# Altium schematic sheet Sheet1.SchDoc
size A4
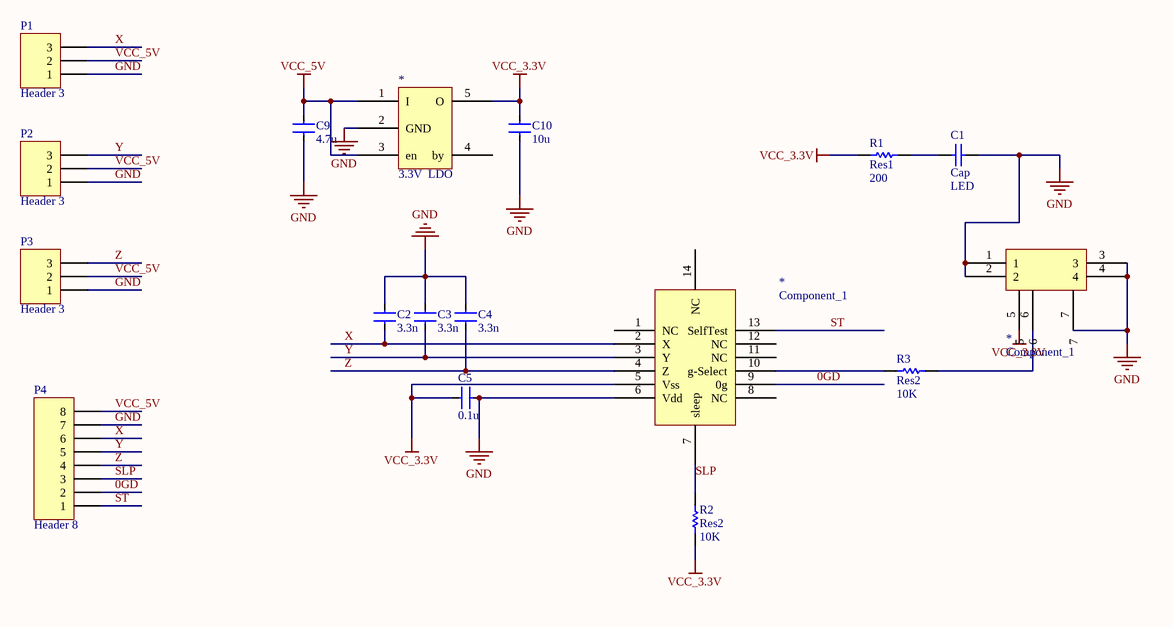
[diagram p0: Sheet1.SchDoc]

## Parts
(Parts that share a designator on the sheet are numbered #1, #2 ... from top to bottom, then left to right.)
*#1  3.3V  LDO  [SOT235]
*#2  Component_1  [kaiguan]
*#3  Component_1  [MMA7361]
C1  Cap  value LED  [1608[0603]]
C2  3.3n  [1608[0603]]
C3  3.3n  [1608[0603]]
C4  3.3n  [1608[0603]]
C5  0.1u  [1608[0603]]
C9  4.7u  [1608[0603]]
C10  10u  [3.2X1.6X1.1]
P1  Header 3  [sh-2.0]
P2  Header 3  [sh-2.0]
P3  Header 3  [sh-2.0]
P4  Header 8  [HDR1X8]
R1  Res1  value 200  [1608[0603]]
R2  Res2  value 10K  [1608[0603]]
R3  Res2  value 10K  [1608[0603]]

## Nets
GND: *#1.2(GND) *#2.1 *#2.2 *#2.3 *#2.4 *#3.6(Vdd) C1.2 C2.1 C3.1 C4.1 C5.2 C9.2 C10.2 P1.1 P2.1 P3.1 P4.7
VCC_3.3V: *#1.5(O) *#3.5(Vss) C5.1 C10.1 R1.1 R2.1
VCC_5V: *#1.1(I) *#1.3(en) C9.1 P1.2 P2.2 P3.2 P4.8
0GD: *#3.9(0g) P4.2
SLP: *#3.7(sleep) P4.3 R2.2
ST: *#3.13(SelfTest) P4.1
X: *#3.2(X) C2.2 P1.3 P4.6
Y: *#3.3(Y) C3.2 P2.3 P4.5
Z: *#3.4(Z) C4.2 P3.3 P4.4
Net*#3_10: *#3.10(g-Select) R3.2
NetC1_1: C1.1 R1.2

Not connected (* = marked no-connect by the designer): *#1 4(by); *#2 5 6 7; *#3 1(NC) 8(NC) 11(NC) 12(NC) 14(NC); R3 1

## Notes on the sheet
- Labels drawn without touching a wire or pin: VCC_3.3V

## Library data of the parts
C1 = Cap: Capacitor; Published: 8-Jun-2000; LatestRevisionDate: 17-Jul-2002; LatestRevisionNote: Re-released for DXP Platform.; PackageReference: RAD-0.3; Publisher: Altium Limited; PackageDescription: Radial Cap, Thru-Hole; 2 Leads; 0.3 in Pin Spacing
C2-C5 C9 C10 = CAP-0.1UF: SMD-CAP
P1-P3 = Header 3: Header, 3-Pin; LatestRevisionDate: 17-Jul-2002; LatestRevisionNote: Re-released for DXP Platform.; Publisher: Altium Limited
P4 = Header 8: Header, 8-Pin; LatestRevisionDate: 17-Jul-2002; LatestRevisionNote: Re-released for DXP Platform.; Publisher: Altium Limited
R1-R3 = Res1: Resistor; Published: 8-Jun-2000; LatestRevisionDate: 17-Jul-2002; LatestRevisionNote: Re-released for DXP Platform.; PackageReference: AXIAL-0.3; Publisher: Altium Limited; PackageDescription: Axial Device, Thru-Hole; 2 Leads; 0.3 in Pin Spacing